# EAGLE design bandpass-triple (EAGLE 6.6.0)
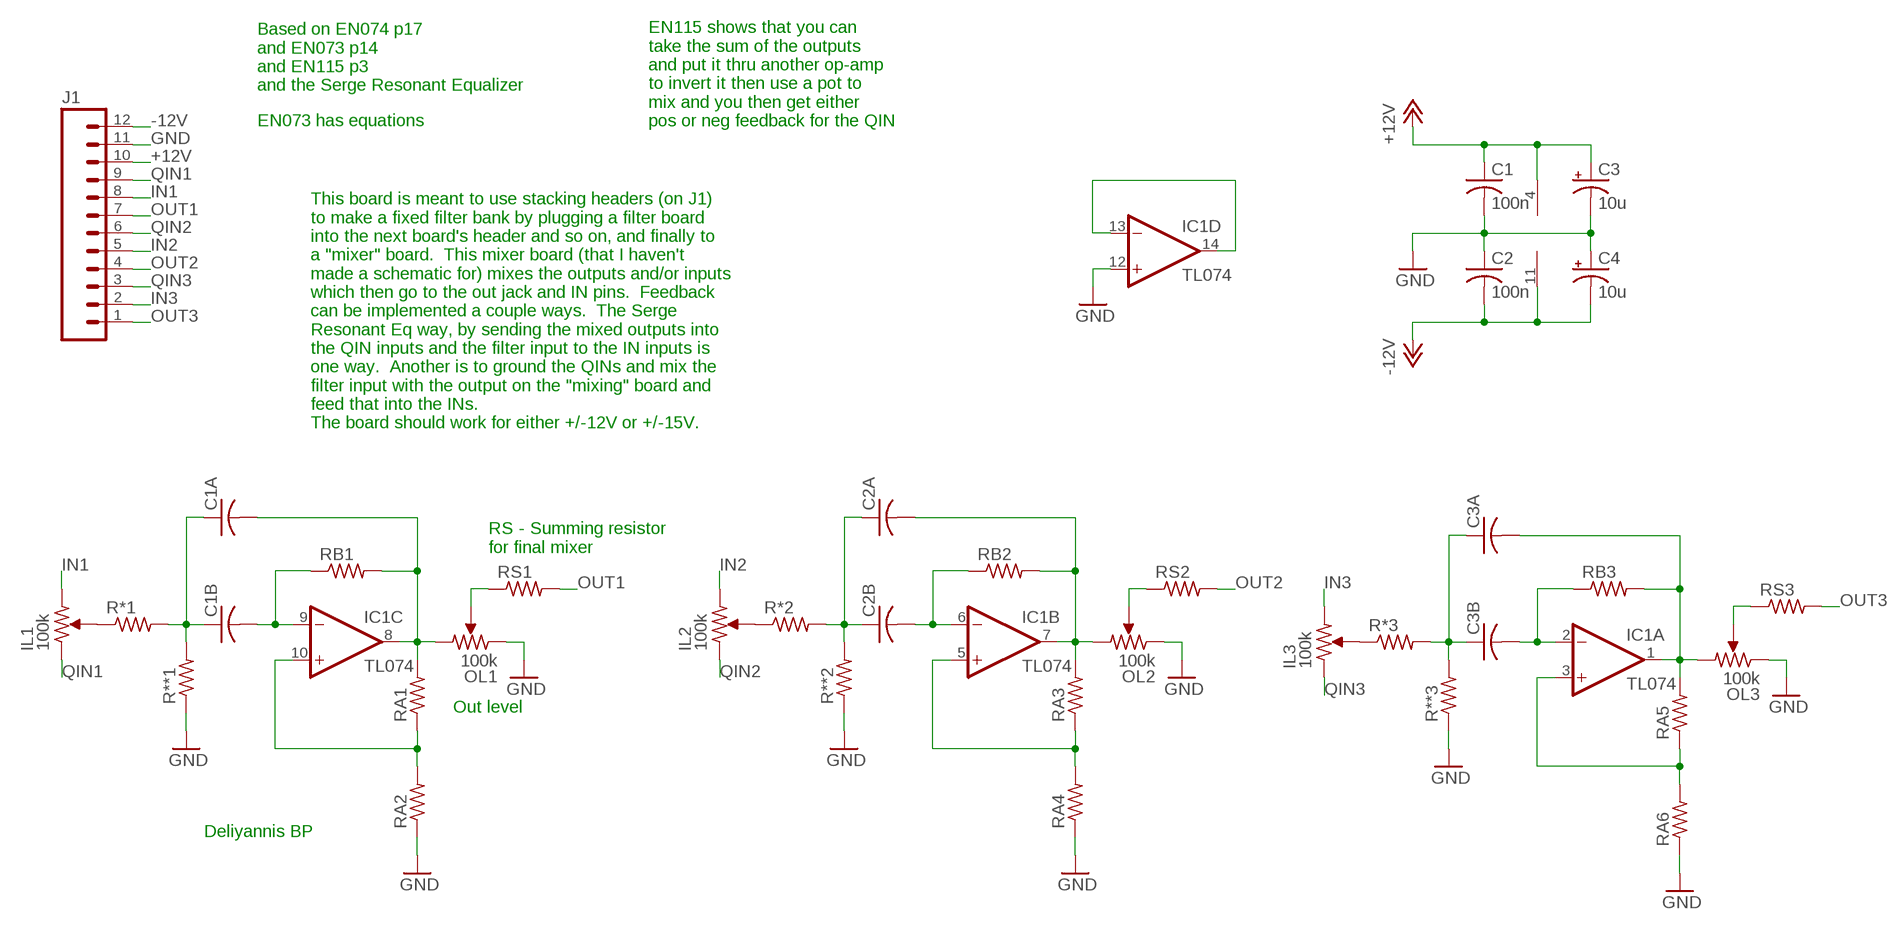
[diagram p0: schematic, sheet 1]

## Parts
C1  100n  C-US050-025X075  [C050-025X075]
C1A  C-US050-025X075  [C050-025X075]
C1B  C-US050-025X075  [C050-025X075]
C2  100n  C-US050-025X075  [C050-025X075]
C2A  C-US050-025X075  [C050-025X075]
C2B  C-US050-025X075  [C050-025X075]
C3  10u  CPOL-USE2.5-5  [E2,5-5]
C3A  C-US050-025X075  [C050-025X075]
C3B  C-US050-025X075  [C050-025X075]
C4  10u  CPOL-USE2.5-5  [E2,5-5]
IC1  TL074  TL074-TOPP  [DIL14]
IL1  100k  POT-BOURNS-PTD901-2015K  [POT-BOURNS-PTD901-2015K]
IL2  100k  POT-BOURNS-PTD901-2015K  [POT-BOURNS-PTD901-2015K]
IL3  100k  POT-BOURNS-PTD901-2015K  [POT-BOURNS-PTD901-2015K]
J1  M12LONGPADS  [1X12_LONGPADS]
OL1  100k  POT-BOURNS-PTD901-2015K  [POT-BOURNS-PTD901-2015K]
OL2  100k  POT-BOURNS-PTD901-2015K  [POT-BOURNS-PTD901-2015K]
OL3  100k  POT-BOURNS-PTD901-2015K  [POT-BOURNS-PTD901-2015K]
R*1  R-US_0207/10  [0207/10]
R*2  R-US_0207/10  [0207/10]
R*3  R-US_0207/10  [0207/10]
R**1  R-US_0207/10  [0207/10]
R**2  R-US_0207/10  [0207/10]
R**3  R-US_0207/10  [0207/10]
RA1  R-US_0207/10  [0207/10]
RA2  R-US_0207/10  [0207/10]
RA3  R-US_0207/10  [0207/10]
RA4  R-US_0207/10  [0207/10]
RA5  R-US_0207/10  [0207/10]
RA6  R-US_0207/10  [0207/10]
RB1  R-US_0207/2V  [0207/2V]
RB2  R-US_0207/2V  [0207/2V]
RB3  R-US_0207/2V  [0207/2V]
RS1  R-US_0207/10  [0207/10]
RS2  R-US_0207/10  [0207/10]
RS3  R-US_0207/10  [0207/10]

## Nets
+12V: C1.1 C3.+ IC1.4(P:V+) J1.10
-12V: C2.2 C4.- IC1.11(P:V-) J1.12
GND: C1.2 C2.1 C3.- C4.+ IC1.12(D:+IN) J1.11 OL1.3 OL2.3 OL3.3 R**1.1 R**2.1 R**3.1 RA2.1 RA4.1 RA6.1
IN1: IL1.1 J1.8
IN2: IL2.1 J1.5
IN3: IL3.1 J1.2
N$1: C1B.2 IC1.9(C:-IN) RB1.1
N$2: C1A.2 IC1.8(C:OUT) OL1.1 RA1.2 RB1.2
N$3: C1A.1 C1B.1 R*1.2 R**1.2
N$4: IC1.10(C:+IN) RA1.1 RA2.2
N$5: C2B.2 IC1.6(B:-IN) RB2.1
N$6: C2A.2 IC1.7(B:OUT) OL2.1 RA3.2 RB2.2
N$7: C2A.1 C2B.1 R*2.2 R**2.2
N$8: IC1.5(B:+IN) RA3.1 RA4.2
N$9: C3B.2 IC1.2(A:-IN) RB3.1
N$10: C3A.2 IC1.1(A:OUT) OL3.1 RA5.2 RB3.2
N$11: C3A.1 C3B.1 R*3.2 R**3.2
N$12: IC1.3(A:+IN) RA5.1 RA6.2
N$13: IC1.13(D:-IN) IC1.14(D:OUT)
N$14: IL1.2 R*1.1
N$15: IL2.2 R*2.1
N$16: IL3.2 R*3.1
N$17: OL1.2 RS1.1
N$18: OL2.2 RS2.1
N$19: OL3.2 RS3.1
OUT1: J1.7 RS1.2
OUT2: J1.4 RS2.2
OUT3: J1.1 RS3.2
QIN1: IL1.3 J1.9
QIN2: IL2.3 J1.6
QIN3: IL3.3 J1.3

## Notes on the sheet
- Based on EN074 p17
  and EN073 p14
  and EN115 p3
  and the Serge Resonant Equalizer
- EN073 has equations
- EN115 shows that you can
  take the sum of the outputs
  and put it thru another op-amp
  to invert it then use a pot to 
  mix and you then get either
  pos or neg feedback for the QIN
- This board is meant to use stacking headers (on J1)
  to make a fixed filter bank by plugging a filter board
  into the next board's header and so on, and finally to
  a "mixer" board.  This mixer board (that I haven't
  made a schematic for) mixes the outputs and/or inputs
  which then go to the out jack and IN pins.  Feedback
  can be implemented a couple ways.  The Serge
  Resonant Eq way, by sending the mixed outputs into
  the QIN inputs and the filter input to the IN inputs is
  one way.  Another is to ground the QINs and mix the
  filter input with the output on the "mixing" board and
  feed that into the INs.
  The board should work for either +/-12V or +/-15V.
- RS - Summing resistor
  for final mixer
- Out level
- Deliyannis BP

## Library data of the parts
C1 C1A C1B C2 C2A C2B C3A C3B = rcl:C-US: CAPACITOR, American symbol
C3 C4 = rcl:CPOL-US: POLARIZED CAPACITOR, American symbol
IC1 = mmoretti:TL074-TOP: OP AMP
IL1-IL3 OL1-OL3 = mmoretti:POT-BOURNS-PTD901-2015K
J1 = SparkFun-Connectors:M12: Header 12 Standard 12-pin 0.1" header. Use with straight break away headers (SKU : PRT-00116), right angle break away headers (PRT-00553), swiss pins (PRT-00743), machine pins (PRT-00117), and female headers (PRT-00115).
R*1-R*3 R**1-R**3 RA1-RA6 RB1-RB3 RS1-RS3 = rcl:R-US_: RESISTOR, American symbol

## Board
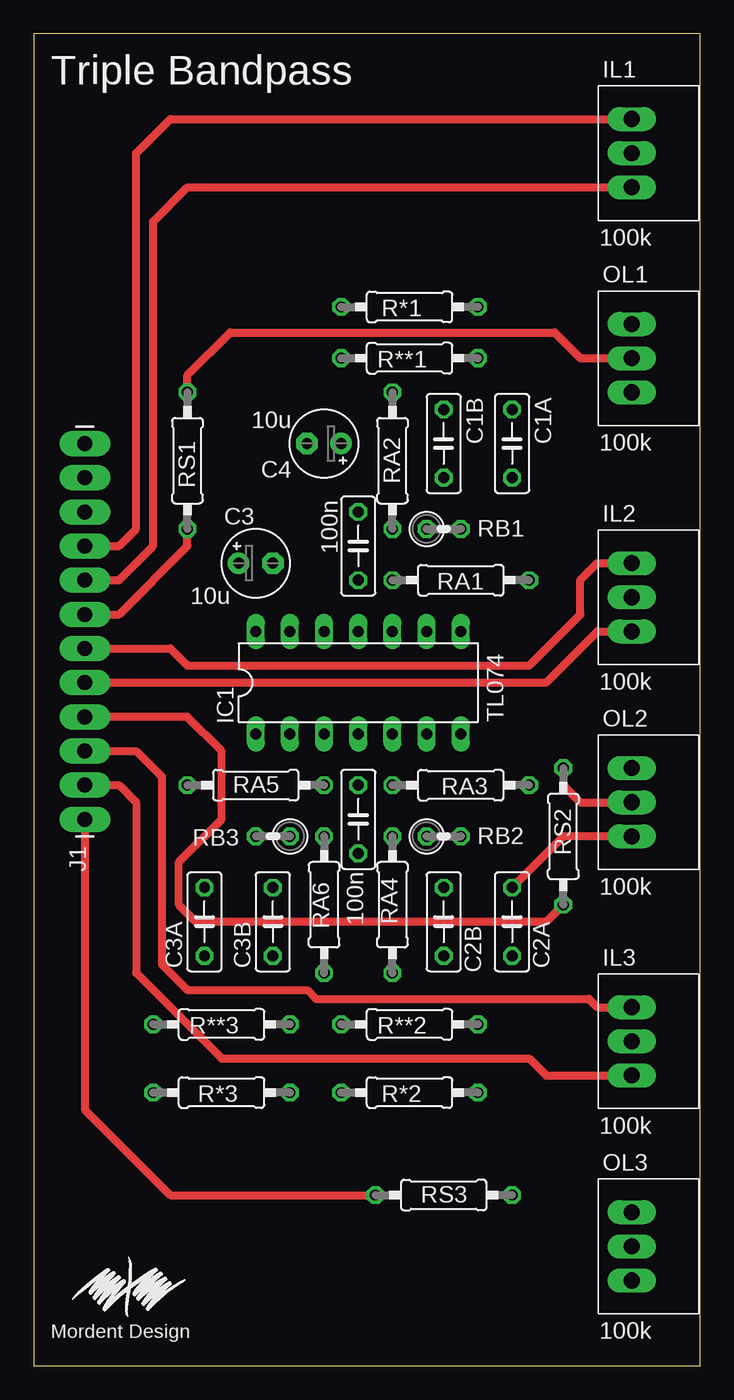
[diagram p1: board, top side]
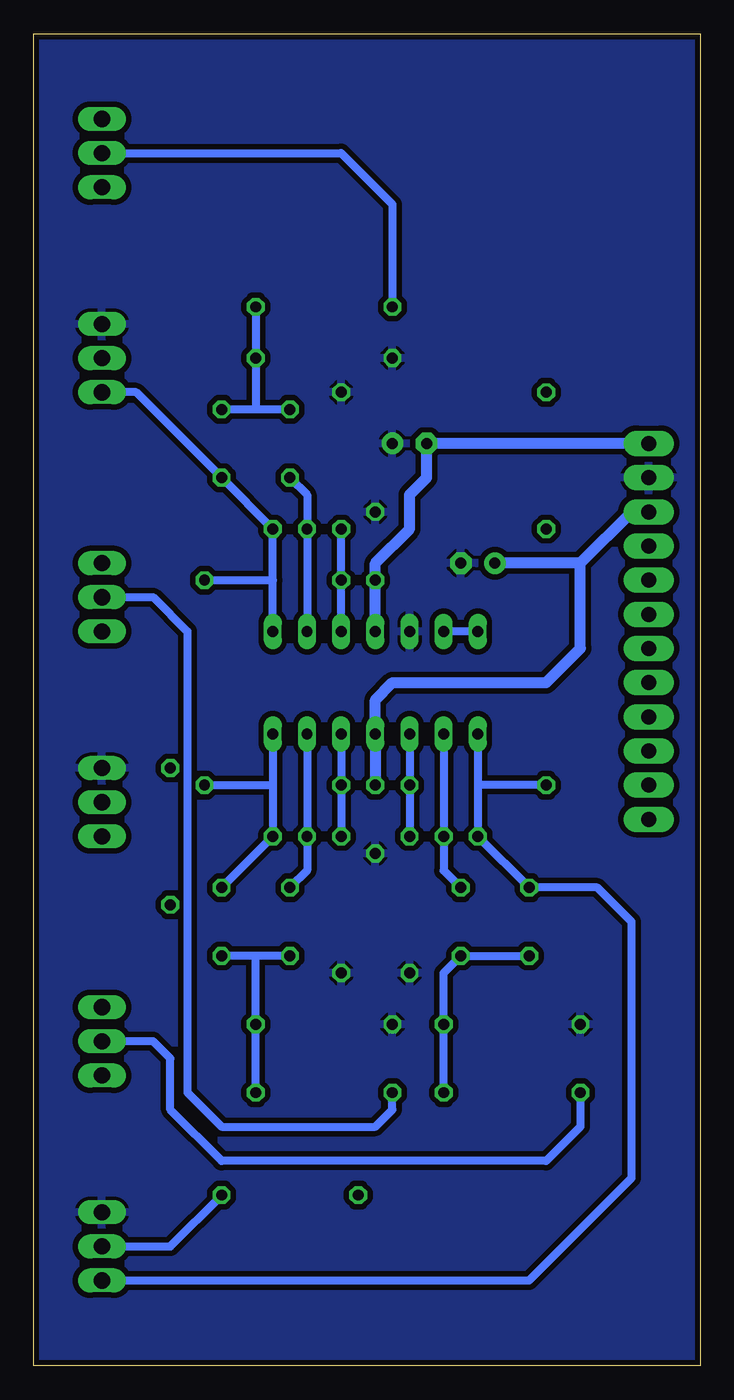
[diagram p2: board, bottom side, seen from below]

Size 49.53 x 99.06 mm. Coordinates in mm from the lower left corner, seen from the top.
Outline: 0,0 49.53,0 49.53,99.06 0,99.06 0,0
Copper layers (1*16): Top 0.035mm / dielectric 1.5mm / Bottom 0.035mm
Design rules "SeeedStudio_2layer_DRU_no_angle_20140221": minimum track width 6mil, minimum drill 12mil, track to track 6mil, track to pad 6mil, pad to pad 6mil, via to via 6mil, smd to smd 0mil, copper to edge 10mil, drill to drill 10mil, minimum pad ring 10mil, minimum via ring 6mil, stop-mask expansion 2mil, vias tented up to drill 100mil, thermal gap 10mil

### Footprints (pad centres in the part's own frame; a part is rotated, then mirrored left to right if it is on the bottom)
C050-025X075 = drill 0.813 octagon: 1 -2.54,0; 2 2.54,0
E2,5-5 = drill 0.813 pad 1.6: + -1.27,0 | drill 0.813 pad 1.6 octagon: - 1.27,0
DIL14 = drill 0.813 long: 1 -7.62,-3.81; 2 -5.08,-3.81; 3 -2.54,-3.81; 4 0,-3.81; 5 2.54,-3.81; 6 5.08,-3.81; 7 7.62,-3.81; 8 7.62,3.81; 9 5.08,3.81; 10 2.54,3.81; 11 0,3.81; 12 -2.54,3.81; 13 -5.08,3.81; 14 -7.62,3.81
POT-BOURNS-PTD901-2015K = drill 1.2 long: 1 0,-2.54; 2 0,0; 3 0,2.54
1X12_LONGPADS = drill 1.118 pad 1.88 long: 1 0,0; 2 2.54,0; 3 5.08,0; 4 7.62,0; 5 10.16,0; 6 12.7,0; 7 15.24,0; 8 17.78,0; 9 20.32,0; 10 22.86,0; 11 25.4,0; 12 27.94,0
0207/10 = drill 0.813 octagon: 1 -5.08,0; 2 5.08,0
0207/2V = drill 0.813 octagon: 1 -1.27,0; 2 1.27,0

### Placement (x,y rotation side)
C1  24.13,40.64 270 top
C1A  35.56,68.58 270 top
C1B  30.48,68.58 270 top
C2  24.13,60.96 270 top
C2A  35.56,33.02 90 top
C2B  30.48,33.02 90 top
C3  16.51,59.69 0 top
C3A  12.7,33.02 90 top
C3B  17.78,33.02 90 top
C4  21.59,68.58 180 top
IC1  24.13,50.8 0 top
IL1  44.45,90.17 0 top
IL2  44.45,57.15 0 top
IL3  44.45,24.13 0 top
J1  3.81,40.64 90 top
OL1  44.45,74.93 0 top
OL2  44.45,41.91 0 top
OL3  44.45,8.89 0 top
R*1  27.94,78.74 0 top
R*2  27.94,20.32 0 top
R*3  13.97,20.32 0 top
R**1  27.94,74.93 0 top
R**2  27.94,25.4 0 top
R**3  13.97,25.4 0 top
RA1  31.75,58.42 0 top
RA2  26.67,67.31 270 top
RA3  31.75,43.18 0 top
RA4  26.67,34.29 90 top
RA5  16.51,43.18 180 top
RA6  21.59,34.29 90 top
RB1  30.48,62.23 0 top
RB2  30.48,39.37 0 top
RB3  17.78,39.37 180 top
RS1  11.43,67.31 270 top
RS2  39.37,39.37 270 top
RS3  30.48,12.7 180 top

### Tracks (layer width: path | path; a pad name or v marks a point on that pad's centre or on a via)
+12V
  Bottom 0.813: C1.1 IC1.4 24.13,49.53 22.86,50.8 11.43,50.8 8.89,53.34 8.89,59.69 | J1.10 5.08,63.5 8.89,59.69 | 8.89,59.69 C3.+
-12V
  Bottom 0.813: IC1.11 C2.2 24.13,59.69 21.59,62.23 21.59,64.77 20.32,66.04 C4.- J1.12
GND
  pour Bottom (isolate 0.406): 0,99.06 49.53,99.06 49.53,0 0,0
IN1
  Top 0.61: J1.8 6.35,58.42 8.89,60.96 8.89,85.09 11.43,87.63 IL1.1
IN2
  Top 0.61: J1.5 38.1,50.8 41.91,54.61 IL2.1
IN3
  Top 0.61: J1.2 6.35,43.18 7.62,41.91 7.62,29.21 13.97,22.86 36.83,22.86 38.1,21.59 IL3.1
N$1
  Bottom 0.61: C1B.2 29.21,64.77 RB1.1 IC1.9
N$2
  Bottom 0.61: IC1.8 31.75,58.42 | 31.75,58.42 RB1.2 C1A.2 41.91,72.39 OL1.1 | RA1.2 31.75,58.42
N$3
  Bottom 0.61: R*1.2 R**1.2 33.02,71.12 | C1B.1 33.02,71.12 | 33.02,71.12 C1A.1
N$4
  Bottom 0.61: IC1.10 RA1.1 RA2.2
N$5
  Bottom 0.61: IC1.6 RB2.1 29.21,36.83 C2B.2
N$6
  Top 0.61: OL2.1 39.37,39.37 C2A.2
  Bottom 0.61: IC1.7 31.75,43.18 | 31.75,43.18 RB2.2 C2A.2 | RA3.2 31.75,43.18
N$7
  Bottom 0.61: R*2.2 R**2.2 33.02,30.48 | C2B.1 33.02,30.48 | 33.02,30.48 C2A.1
N$8
  Bottom 0.61: IC1.5 RA3.1 RA4.2
N$9
  Bottom 0.61: IC1.2 RB3.1 19.05,36.83 C3B.2
N$10
  Bottom 0.61: IC1.1 16.51,43.18 | 16.51,43.18 RB3.2 C3A.2 7.62,35.56 5.08,33.02 5.08,13.97 12.7,6.35 OL3.1 | RA5.2 16.51,43.18
N$11
  Bottom 0.61: R*3.2 R**3.2 19.05,29.21 C3B.1 C3A.1
N$12
  Bottom 0.61: IC1.3 RA5.1 RA6.2
N$13
  Bottom 0.61: IC1.14 IC1.13
N$14
  Bottom 0.61: IL1.2 26.67,90.17 22.86,86.36 R*1.1
N$15
  Bottom 0.61: IL2.2 40.64,57.15 38.1,54.61 38.1,20.32 35.56,17.78 24.13,17.78 22.86,19.05 R*2.1
N$16
  Bottom 0.61: R*3.1 8.89,17.78 11.43,15.24 35.56,15.24 39.37,19.05 39.37,22.86 40.64,24.13 IL3.2
N$17
  Top 0.61: RS1.1 11.43,73.66 14.61,76.83 38.73,76.83 40.64,74.93 OL1.2
N$18
  Top 0.61: RS2.1 39.37,43.18 40.64,41.91 OL2.2
N$19
  Bottom 0.61: OL3.2 39.37,8.89 RS3.1
OUT1
  Top 0.61: J1.7 6.35,55.88 11.43,60.96 RS1.2
OUT2
  Top 0.61: RS2.2 38.1,33.02 12.06,33.02 10.79,34.29 10.79,37.47 13.97,40.64 13.97,45.72 11.43,48.26 J1.4
OUT3
  Top 0.61: J1.1 3.81,19.05 10.16,12.7 RS3.2
QIN1
  Top 0.61: J1.9 6.35,60.96 7.62,62.23 7.62,90.17 10.16,92.71 IL1.3
QIN2
  Top 0.61: J1.6 10.16,53.34 11.43,52.07 36.83,52.07 40.64,55.88 40.64,58.42 41.91,59.69 IL2.3
QIN3
  Top 0.61: IL3.3 41.91,26.67 41.27,27.3 20.95,27.3 20.32,27.94 11.43,27.94 9.53,29.84 9.53,43.81 7.62,45.72 J1.3

### Text on the board
tPlace: Triple Bandpass | Mordent Design